# EAGLE design rs232module (EAGLE 6.5.0)
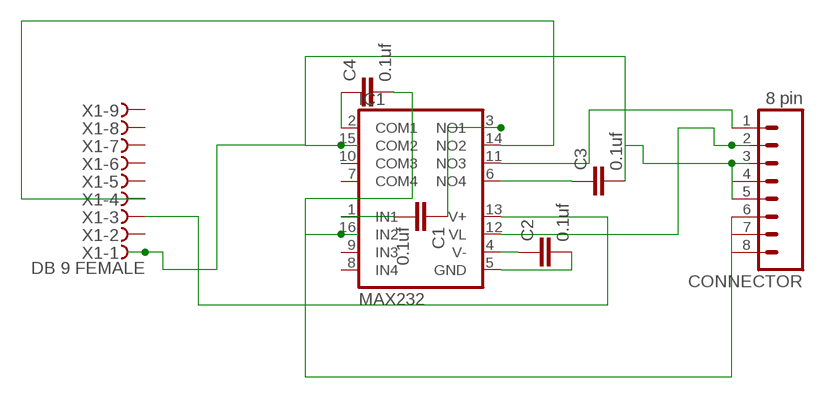
[diagram p0: schematic, sheet 1]

## Parts
C1  0.1uf  C2,5-3  [C2.5-3]
C2  0.1uf  C2,5-3  [C2.5-3]
C3  0.1uf  C2,5-3  [C2.5-3]
C4  0.1uf  C2,5-3  [C2.5-3]
CONNECTOR  8 pin  M08  [08P]
IC1  MAX232  MAX313EPE  [DIL16]
X1  DB 9 FEMALE  D-SUB9-H2M09ST  [H2M09ST]

## Nets
N$1: C1.2 IC1.1(IN1)
N$2: C1.1 IC1.3(NO1)
N$3: C2.1 IC1.4(V-)
N$4: C2.2 IC1.5(GND)
N$5: C3.1 IC1.6(NO4)
N$6: C3.2 CONNECTOR.3 CONNECTOR.4 CONNECTOR.5 IC1.15(COM2) X1.1
N$7: C4.1 IC1.2(COM1)
N$8: C4.2 CONNECTOR.6 CONNECTOR.7 CONNECTOR.8 IC1.16(IN2)
N$9: IC1.13(V+) X1.3
N$10: IC1.14(NO2) X1.4
N$11: CONNECTOR.1 IC1.11(NO3)
N$12: CONNECTOR.2 IC1.12(VL)
Unconnected: IC1.7(COM4) IC1.8(IN4) IC1.9(IN3) IC1.10(COM3) X1.2 X1.5 X1.6 X1.7 X1.8 X1.9

## Library data of the parts
C1-C4 = capacitor-wima:C: CAPACITOR naming: grid - package width
CONNECTOR = con-amp-quick:M08: AMP QUICK CONNECTOR; OC_FARNELL: unknown; OC_NEWARK: unknown
IC1 = maxim:MAX313: 10?, Quad, SPST, CMOS Analog Switches Source: http://datasheets.maxim-ic.com/en/ds/MAX312-MAX314.pdf; MPN: MAX313EPE+; OC_FARNELL: unknown; OC_NEWARK: 99K3220
X1 = con-thomas-betts:D-SUB9-: D-Subminiatur Connector Source: Electronioc Interconnects European Edition 1998; OC_FARNELL: unknown; OC_NEWARK: unknown

## Board
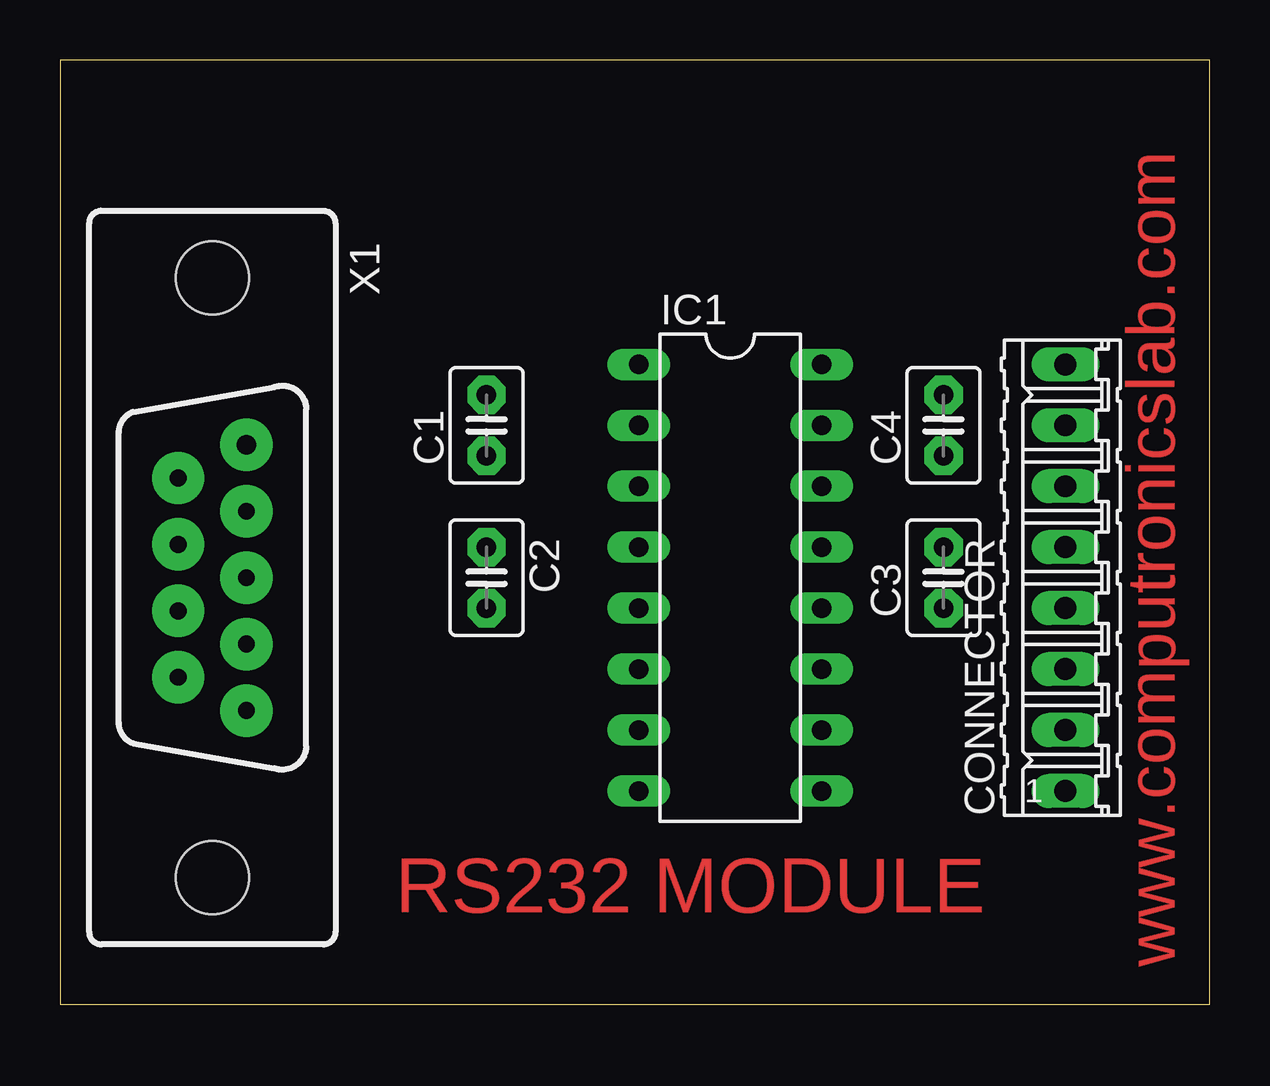
[diagram p1: board, top side]
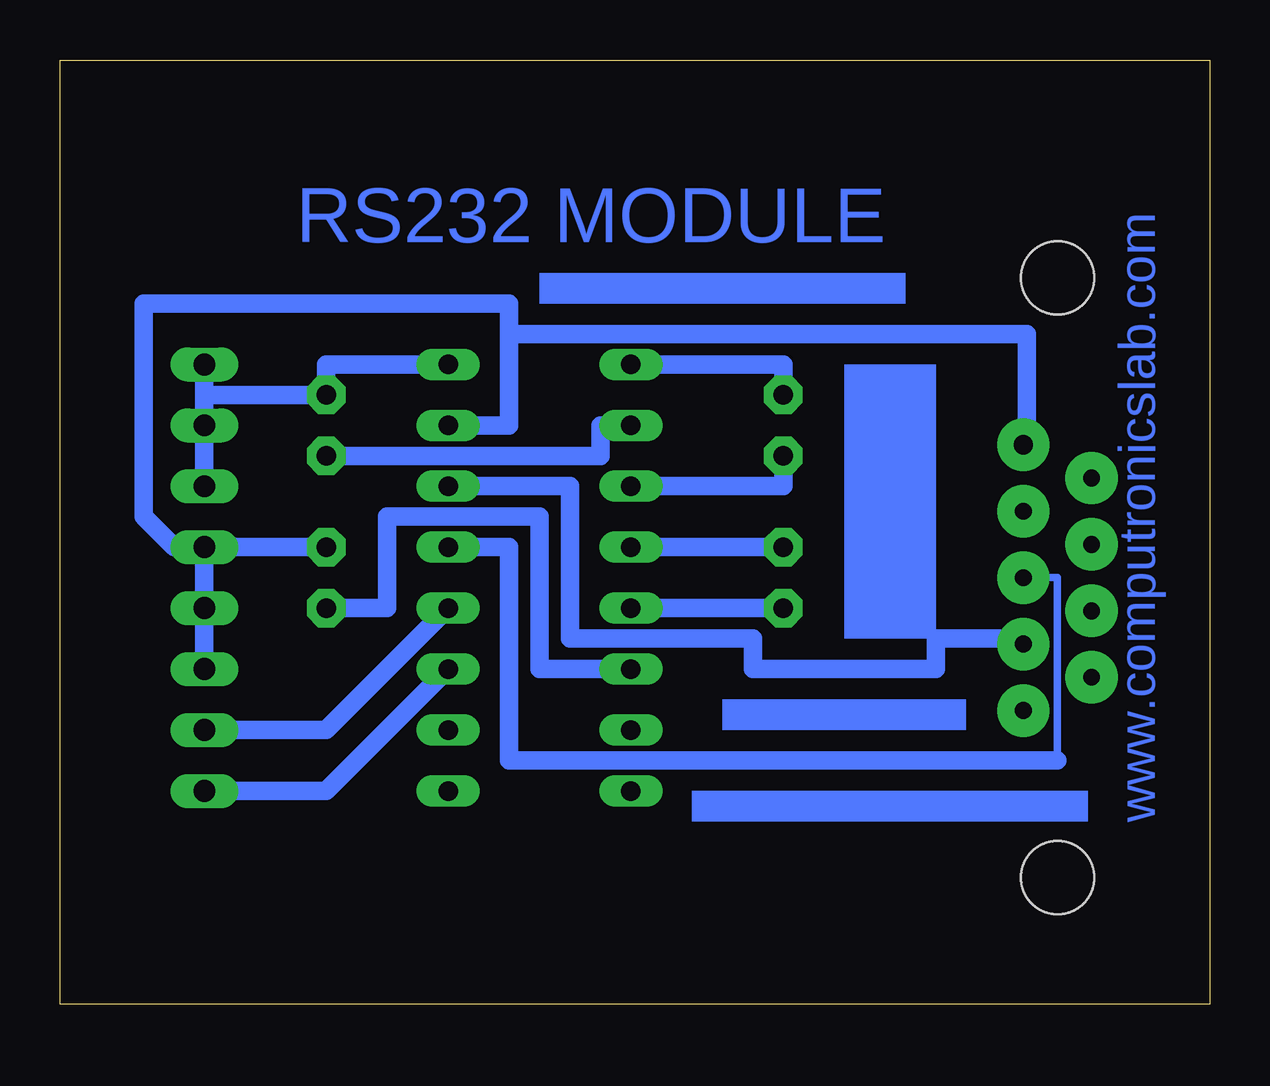
[diagram p2: board, bottom side, seen from below]

Size 47.93 x 39.36 mm. Coordinates in mm from the lower left corner, seen from the top.
Outline: 0,0 47.93,0 47.93,39.36 0,39.36 0,0
Copper layers (1*16): Top 0.035mm / dielectric 1.5mm / Bottom 0.035mm
Design rules "default *": minimum track width 30mil, minimum drill 24mil, track to track 8mil, track to pad 8mil, pad to pad 8mil, via to via 8mil, smd to smd 8mil, copper to edge 40mil, drill to drill 8mil, minimum pad ring 10mil, minimum via ring 8mil, stop-mask expansion 4mil, vias tented up to drill 0mil, thermal gap 10mil

### Footprints (pad centres in the part's own frame; a part is rotated, then mirrored left to right if it is on the bottom)
C2.5-3 = drill 0.813 pad 1.6 octagon: 1 -1.27,0; 2 1.27,0
08P = drill 0.914 long: 1 -8.89,0; 2 -6.35,0; 3 -3.81,0; 4 -1.27,0; 5 1.27,0; 6 3.81,0; 7 6.35,0; 8 8.89,0
DIL16 = drill 0.813 long: 1 -8.89,-3.81; 2 -6.35,-3.81; 3 -3.81,-3.81; 4 -1.27,-3.81; 5 1.27,-3.81; 6 3.81,-3.81; 7 6.35,-3.81; 8 8.89,-3.81; 9 8.89,3.81; 10 6.35,3.81; 11 3.81,3.81; 12 1.27,3.81; 13 -1.27,3.81; 14 -3.81,3.81; 15 -6.35,3.81; 16 -8.89,3.81
H2M09ST = drill 0.8 pad 2.184: 1 -5.537,1.422 | drill 0.7 pad 2.184: 2 -2.769,1.422; 3 0,1.422; 4 2.769,1.422; 5 5.537,1.422; 6 -4.153,-1.422; 7 -1.384,-1.422; 8 1.384,-1.422; 9 4.153,-1.422 | hole 3.048: -12.497,0; 12.497,0

### Placement (x,y rotation side)
C1  17.78,24.13 90 top
C2  17.78,17.78 270 top
C3  36.83,17.78 90 top
C4  36.83,24.13 90 top
CONNECTOR  41.91,17.78 90 top
IC1  27.94,17.78 270 top
X1  6.35,17.78 270 top

### Tracks (layer width: path | path; a pad name or v marks a point on that pad's centre or on a via)
N$1
  Bottom 0.762: C1.2 17.78,26.67 IC1.1
N$2
  Bottom 0.762: C1.1 17.78,21.59 IC1.3
N$3
  Bottom 0.762: C2.1 IC1.4
N$4
  Bottom 0.762: C2.2 IC1.5
N$5
  Bottom 0.762: IC1.6 27.94,13.97 27.94,20.32 34.29,20.32 34.29,16.51 C3.1
N$6
  Bottom 0.762: CONNECTOR.3 CONNECTOR.4 CONNECTOR.5 | CONNECTOR.5 C3.2 | 29.21,26.67 29.21,27.94 27.94,27.94 11.43,27.94 7.62,27.94 7.62,26.67 7.62,24.13 X1.1 | 29.21,26.67 29.21,24.13 IC1.15 | CONNECTOR.5 43.18,19.05 44.45,20.32 44.45,29.21 31.75,29.21 29.21,29.21 29.21,26.67
N$7
  Bottom 0.762: IC1.2 25.4,24.13 25.4,22.86 C4.1
N$8
  Bottom 0.762: CONNECTOR.6 CONNECTOR.7 41.91,25.4 | 41.91,25.4 CONNECTOR.8 | IC1.16 36.83,26.67 C4.2 41.91,25.4
N$9
  Bottom 0.305: 6.35,10.16 6.35,11.43 6.35,17.78 X1.3
  Bottom 0.762: IC1.13 29.21,19.05 29.21,16.51 29.21,10.16 7.62,10.16 6.35,10.16
N$10
  Bottom 0.762: IC1.14 26.67,21.59 26.67,15.24 19.05,15.24 19.05,13.97 11.43,13.97 11.43,15.24 7.62,15.24 X1.4
N$11
  Bottom 0.762: IC1.11 36.83,8.89 CONNECTOR.1
N$12
  Bottom 0.762: IC1.12 36.83,11.43 CONNECTOR.2
(copper drawn outside any net)
  shapes: Bottom area x4

### Text on the board
Top: www.computronicslab.com | RS232 MODULE
Bottom: www.computronicslab.com | RS232 MODULE